# Altium project ghetto_cuda.PrjPcb (part 2 of 2)

## Sheet FPGA_IO_4.SchDoc
size A
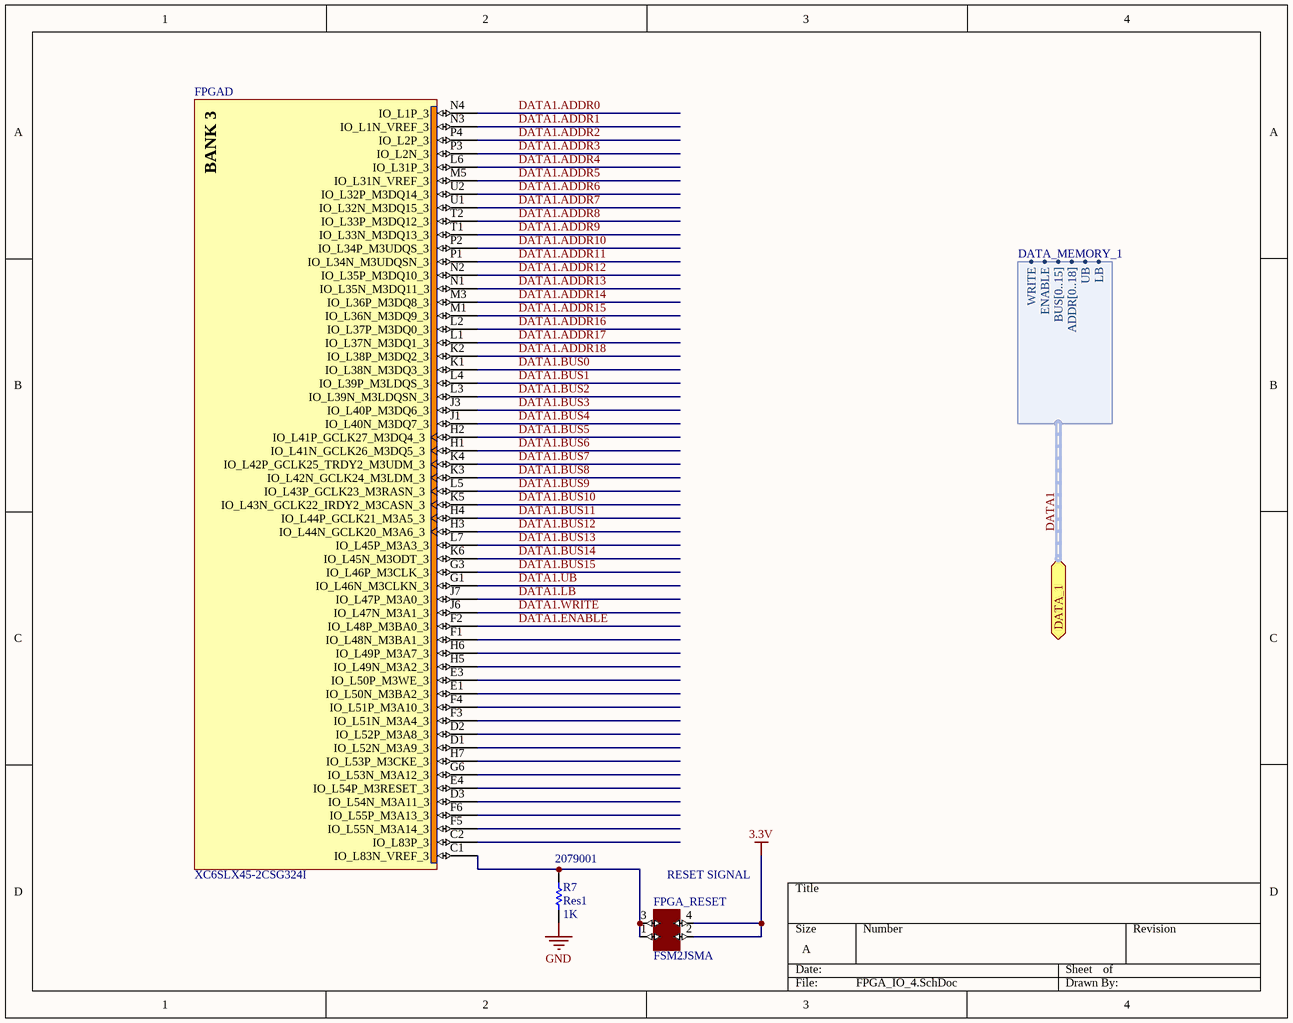
[diagram p12: FPGA_IO_4.SchDoc]

### Parts
FPGA  XC6SLX45-2CSG324I  [CSG324]  (part D of 8)
FPGA_RESET  FSM2JSMA  [Button]
R7  Res1  value 1K  Supplier Part Number 1: 2079001  [C1206]

### Ports
DATA_1 (harness DATA_MEMORY_1)

### Harnesses
DATA_MEMORY_1: WRITE, ENABLE, BUS[0..15], ADDR[0..18], UB, LB

### Nets
3.3V: FPGA_RESET.2 FPGA_RESET.4
GND: R7.2
DATA1.ADDR0: FPGA.N4(IO_L1P_3)
DATA1.ADDR1: FPGA.N3(IO_L1N_VREF_3)
DATA1.ADDR2: FPGA.P4(IO_L2P_3)
DATA1.ADDR3: FPGA.P3(IO_L2N_3)
DATA1.ADDR4: FPGA.L6(IO_L31P_3)
DATA1.ADDR5: FPGA.M5(IO_L31N_VREF_3)
DATA1.ADDR6: FPGA.U2(IO_L32P_M3DQ14_3)
DATA1.ADDR7: FPGA.U1(IO_L32N_M3DQ15_3)
DATA1.ADDR8: FPGA.T2(IO_L33P_M3DQ12_3)
DATA1.ADDR9: FPGA.T1(IO_L33N_M3DQ13_3)
DATA1.ADDR10: FPGA.P2(IO_L34P_M3UDQS_3)
DATA1.ADDR11: FPGA.P1(IO_L34N_M3UDQSN_3)
DATA1.ADDR12: FPGA.N2(IO_L35P_M3DQ10_3)
DATA1.ADDR13: FPGA.N1(IO_L35N_M3DQ11_3)
DATA1.ADDR14: FPGA.M3(IO_L36P_M3DQ8_3)
DATA1.ADDR15: FPGA.M1(IO_L36N_M3DQ9_3)
DATA1.ADDR16: FPGA.L2(IO_L37P_M3DQ0_3)
DATA1.ADDR17: FPGA.L1(IO_L37N_M3DQ1_3)
DATA1.ADDR18: FPGA.K2(IO_L38P_M3DQ2_3)
DATA1.BUS0: FPGA.K1(IO_L38N_M3DQ3_3)
DATA1.BUS1: FPGA.L4(IO_L39P_M3LDQS_3)
DATA1.BUS2: FPGA.L3(IO_L39N_M3LDQSN_3)
DATA1.BUS3: FPGA.J3(IO_L40P_M3DQ6_3)
DATA1.BUS4: FPGA.J1(IO_L40N_M3DQ7_3)
DATA1.BUS5: FPGA.H2(IO_L41P_GCLK27_M3DQ4_3)
DATA1.BUS6: FPGA.H1(IO_L41N_GCLK26_M3DQ5_3)
DATA1.BUS7: FPGA.K4(IO_L42P_GCLK25_TRDY2_M3UDM_3)
DATA1.BUS8: FPGA.K3(IO_L42N_GCLK24_M3LDM_3)
DATA1.BUS9: FPGA.L5(IO_L43P_GCLK23_M3RASN_3)
DATA1.BUS10: FPGA.K5(IO_L43N_GCLK22_IRDY2_M3CASN_3)
DATA1.BUS11: FPGA.H4(IO_L44P_GCLK21_M3A5_3)
DATA1.BUS12: FPGA.H3(IO_L44N_GCLK20_M3A6_3)
DATA1.BUS13: FPGA.L7(IO_L45P_M3A3_3)
DATA1.BUS14: FPGA.K6(IO_L45N_M3ODT_3)
DATA1.BUS15: FPGA.G3(IO_L46P_M3CLK_3)
DATA1.ENABLE: FPGA.F2(IO_L48P_M3BA0_3)
DATA1.LB: FPGA.J7(IO_L47P_M3A0_3)
DATA1.UB: FPGA.G1(IO_L46N_M3CLKN_3)
DATA1.WRITE: FPGA.J6(IO_L47N_M3A1_3)
NetFPGA_C1: FPGA.C1(IO_L83N_VREF_3) FPGA_RESET.1 FPGA_RESET.3 R7.1

Not connected (* = marked no-connect by the designer): FPGA C2(IO_L83P_3) D1(IO_L52N_M3A9_3) D2(IO_L52P_M3A8_3) D3(IO_L54N_M3A11_3) E1(IO_L50N_M3BA2_3) E3(IO_L50P_M3WE_3) E4(IO_L54P_M3RESET_3) F1(IO_L48N_M3BA1_3) F3(IO_L51N_M3A4_3) F4(IO_L51P_M3A10_3) F5(IO_L55N_M3A14_3) F6(IO_L55P_M3A13_3) G6(IO_L53N_M3A12_3) H5(IO_L49N_M3A2_3) H6(IO_L49P_M3A7_3) H7(IO_L53P_M3CKE_3)

### Buses and harness runs
harness DATA1 = port DATA_1

### Notes on the sheet
- (near FPGA_RESET) RESET SIGNAL
- (in symbol CMP-0067-00402-1, part D) BANK 3

### Library data of the parts
FPGA = CMP-0067-00402-1: Spartan-6 LX 1.2V FPGA, 218 User I/Os, 324-Ball Chip-Scale BGA (0.8mm Pitch), Speed Grade 2, Industrial Grade, Pb-Free; Code_JEDEC: MO-275-KKAC-1; PackageDescription: 324-Ball Chip-Scale BGA (CSG324) Package, 0.8 mm Pitch; DatasheetVersion: ver1.6, Nov-2010; PackageVersion: ver1.1, Nov-2009; PackageReference: CSG324
FPGA_RESET = switch-button
R7 = Res1: Resistor; Manufacturer: WELWYN; Manufacturer Part Number: ASC1206-1K0FT5; Description: WELWYN - ASC1206-1K0FT5 - RESISTOR, ANTI SULPHUR, 1206, 1K0; Product Range: WELWYN - ASC Series; Resistance: 1; Power Rating: 250; Resistance Tolerance: ± 1%; Resistor Case Style: 1206 [3216 Metric]; Resistor Element Material: Thick Film; Temperature Coefficient: ± 100; Voltage Rating: 200; SVHC: No SVHC (16-Jun-2014); Resistor Mounting: SMD<!--FANDB--><div class="features-and-benefits-container"></div>; Published: 8-Jun-2000; LatestRevisionDate: 17-Jul-2002; LatestRevisionNote: Re-released for DXP Platform.; PackageReference: AXIAL-0.3; Publisher: Altium Limited; PackageDescription: Axial Device, Thru-Hole; 2 Leads; 0.3 in Pin Spacing; Supplier 1: Farnell; RoHS: YES; Stock 1: 41610; Pricing 1: 100=0,1895, 500=0,1514, 1000=0,1401, 5000=0,1112 (EUR); Packaging: Cut Tape; MSL: -; ComponentLink1URL: http://www.farnell.com/datasheets/1682355.pdf; ComponentLink1Description: http://www.farnell.com/datasheets/1682355.pdf

## Sheet FPGA_CLK_SUSPEND.SchDoc
size A
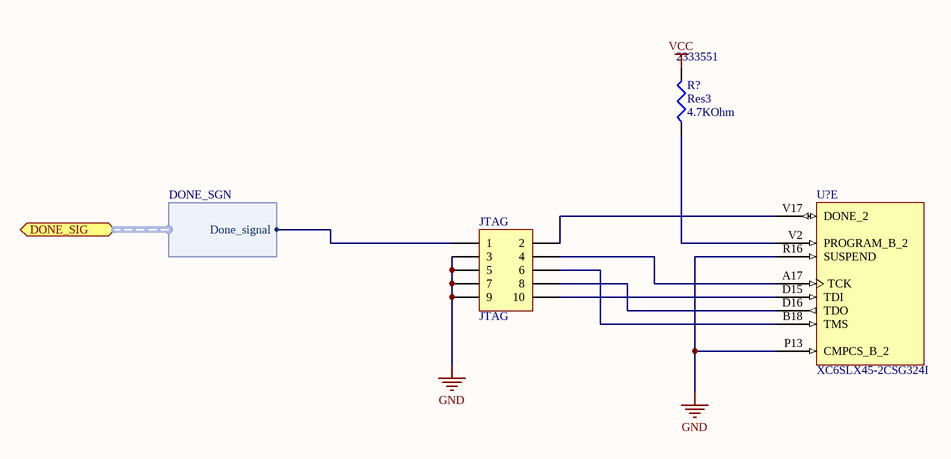
[diagram p13: FPGA_CLK_SUSPEND.SchDoc]

### Parts
JTAG  JTAG  [HDR2X5]
R?  Res3  value 4.7KOhm  Supplier Part Number 1: 2333551  [C1206]
U?  XC6SLX45-2CSG324I  [CSG324]  (part E of 8)

### Ports
DONE_SIG (harness DONE_SGN)

### Harnesses
DONE_SGN: Done_signal

### Nets
GND: JTAG.3 JTAG.5 JTAG.7 JTAG.9 U?.P13(CMPCS_B_2) U?.R16(SUSPEND)
VCC: R?.2
NetJTAG_1: JTAG.1 ; port DONE_SIG.Done_signal
NetJTAG_2: JTAG.2 U?.V17(DONE_2)
NetJTAG_4: JTAG.4 U?.A17(TCK)
NetJTAG_6: JTAG.6 U?.B18(TMS)
NetJTAG_8: JTAG.8 U?.D16(TDO)
NetJTAG_10: JTAG.10 U?.D15(TDI)
NetR?_1: R?.1 U?.V2(PROGRAM_B_2)

### Library data of the parts
JTAG = Header 5X2: Header, 5-Pin, Dual row; LatestRevisionDate: 17-Jul-2002; LatestRevisionNote: Re-released for DXP Platform.; Publisher: Altium Limited
R? = Res3: Resistor; Manufacturer: BOURNS; Manufacturer Part Number: CR1206-FX-4701ELF; Description: BOURNS - CR1206-FX-4701ELF - RESISTOR THICK FILM, 4.7KOHM, 1%, 1206; Product Range: BOURNS - CR Series; Resistance: 4.7; Power Rating: 250; Resistance Tolerance: ± 1%; Resistor Case Style: 1206 [3216 Metric]; Resistor Element Material: Thick Film; Temperature Coefficient: ± 100; Voltage Rating: 200; SVHC: No SVHC (16-Jun-2014; Published: 8-Jun-2000; LatestRevisionDate: 29-May-2009; LatestRevisionNote: IPC-7351 Footprint Added.; PackageReference: J1-0603; Publisher: Altium Limited; PackageDescription: Chip Resistor; Supplier 1: Farnell; RoHS: YES; Stock 1: 12041; Pricing 1: 1=0.453, 10=0.34, 50=0.278, 100=0.216, 500=0.1607, 1000=0.1339 (EUR); Packaging: Cut Tape; MSL: -; ComponentLink1URL: http://www.farnell.com/datasheets/691949.pdf; ComponentLink1Description: http://www.farnell.com/datasheets/691949.pdf
U? = CMP-0067-00402-1: as FPGA on sheet FPGA_IO_4; Code_JEDEC: MO-275-KKAC-1; PackageDescription: 324-Ball Chip-Scale BGA (CSG324) Package, 0.8 mm Pitch; DatasheetVersion: ver1.6, Nov-2010; PackageVersion: ver1.1, Nov-2009; PackageReference: CSG324

## Sheet FPGA_GND.SchDoc
size A
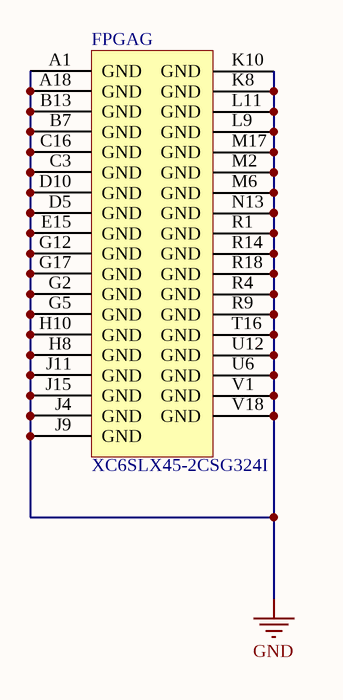
[diagram p14: FPGA_GND.SchDoc]

### Parts
FPGA  XC6SLX45-2CSG324I  [CSG324]  (part G of 8)

### Nets
GND: FPGA.A1(GND) FPGA.A18(GND) FPGA.B7(GND) FPGA.B13(GND) FPGA.C3(GND) FPGA.C16(GND) FPGA.D5(GND) FPGA.D10(GND) FPGA.E15(GND) FPGA.G2(GND) FPGA.G5(GND) FPGA.G12(GND) FPGA.G17(GND) FPGA.H8(GND) FPGA.H10(GND) FPGA.J4(GND) FPGA.J9(GND) FPGA.J11(GND) FPGA.J15(GND) FPGA.K8(GND) FPGA.K10(GND) FPGA.L9(GND) FPGA.L11(GND) FPGA.M2(GND) FPGA.M6(GND) FPGA.M17(GND) FPGA.N13(GND) FPGA.R1(GND) FPGA.R4(GND) FPGA.R9(GND) FPGA.R14(GND) FPGA.R18(GND) FPGA.T16(GND) FPGA.U6(GND) FPGA.U12(GND) FPGA.V1(GND) FPGA.V18(GND)

### Library data of the parts
FPGA = CMP-0067-00402-1: as FPGA on sheet FPGA_IO_4; Code_JEDEC: MO-275-KKAC-1; PackageDescription: 324-Ball Chip-Scale BGA (CSG324) Package, 0.8 mm Pitch; DatasheetVersion: ver1.6, Nov-2010; PackageVersion: ver1.1, Nov-2009; PackageReference: CSG324

## Sheet FPGA_VCC.SchDoc
size A
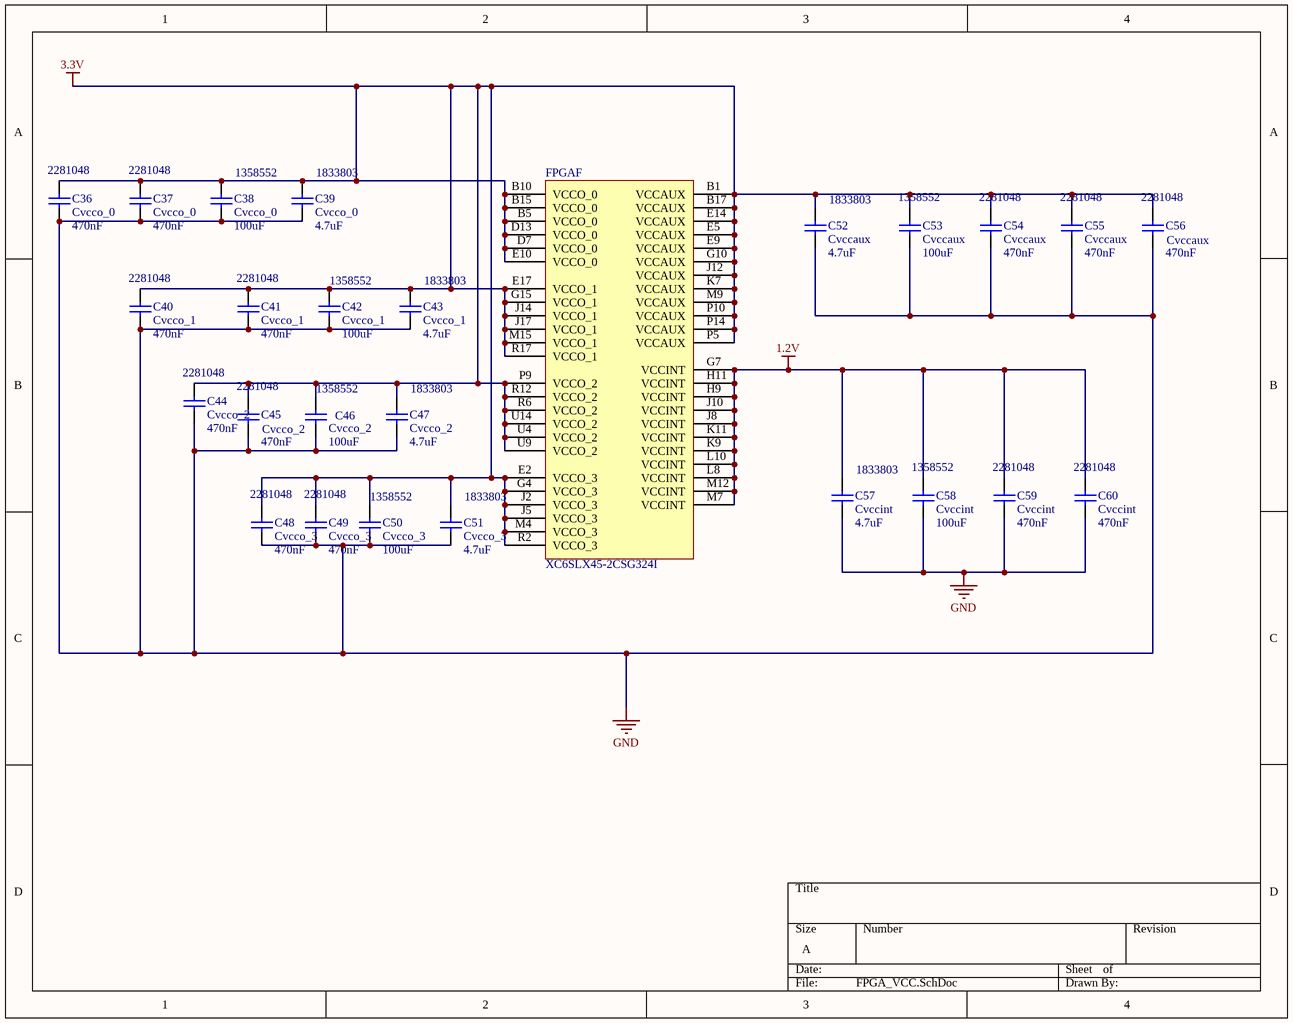
[diagram p15: FPGA_VCC.SchDoc]

### Parts
C36  Cvcco_0  value 470nF  Supplier Part Number 1: 2281048  [C1206]
C37  Cvcco_0  value 470nF  Supplier Part Number 1: 2281048  [C1206]
C38  Cvcco_0  value 100uF  Supplier Part Number 1: 1358552  [C1206]
C39  Cvcco_0  value 4.7uF  Supplier Part Number 1: 1833803  [C1206]
C40  Cvcco_1  value 470nF  Supplier Part Number 1: 2281048  [C1206]
C41  Cvcco_1  value 470nF  Supplier Part Number 1: 2281048  [C1206]
C42  Cvcco_1  value 100uF  Supplier Part Number 1: 1358552  [C1206]
C43  Cvcco_1  value 4.7uF  Supplier Part Number 1: 1833803  [C1206]
C44  Cvcco_2  value 470nF  Supplier Part Number 1: 2281048  [C1206]
C45  Cvcco_2  value 470nF  Supplier Part Number 1: 2281048  [C1206]
C46  Cvcco_2  value 100uF  Supplier Part Number 1: 1358552  [C1206]
C47  Cvcco_2  value 4.7uF  Supplier Part Number 1: 1833803  [C1206]
C48  Cvcco_3  value 470nF  Supplier Part Number 1: 2281048  [C1206]
C49  Cvcco_3  value 470nF  Supplier Part Number 1: 2281048  [C1206]
C50  Cvcco_3  value 100uF  Supplier Part Number 1: 1358552  [C1206]
C51  Cvcco_3  value 4.7uF  Supplier Part Number 1: 1833803  [C1206]
C52  Cvccaux  value 4.7uF  Supplier Part Number 1: 1833803  [C1206]
C53  Cvccaux  value 100uF  Supplier Part Number 1: 1358552  [C1206]
C54  Cvccaux  value 470nF  Supplier Part Number 1: 2281048  [C1206]
C55  Cvccaux  value 470nF  Supplier Part Number 1: 2281048  [C1206]
C56  Cvccaux  value 470nF  Supplier Part Number 1: 2281048  [C1206]
C57  Cvccint  value 4.7uF  Supplier Part Number 1: 1833803  [C1206]
C58  Cvccint  value 100uF  Supplier Part Number 1: 1358552  [C1206]
C59  Cvccint  value 470nF  Supplier Part Number 1: 2281048  [C1206]
C60  Cvccint  value 470nF  Supplier Part Number 1: 2281048  [C1206]
FPGA  XC6SLX45-2CSG324I  [CSG324]  (part F of 8)

### Nets
1.2V: C57.2 C58.2 C59.1 C60.1 FPGA.G7(VCCINT) FPGA.H9(VCCINT) FPGA.H11(VCCINT) FPGA.J8(VCCINT) FPGA.J10(VCCINT) FPGA.K9(VCCINT) FPGA.K11(VCCINT) FPGA.L8(VCCINT) FPGA.L10(VCCINT) FPGA.M7(VCCINT) FPGA.M12(VCCINT)
3.3V: C36.1 C37.1 C38.2 C39.2 C40.1 C41.1 C42.1 C43.2 C44.1 C45.1 C46.2 C47.2 C48.1 C49.1 C50.2 C51.2 C52.2 C53.2 C54.1 C55.1 C56.1 FPGA.B1(VCCAUX) FPGA.B5(VCCO_0) FPGA.B10(VCCO_0) FPGA.B15(VCCO_0) FPGA.B17(VCCAUX) FPGA.D7(VCCO_0) FPGA.D13(VCCO_0) FPGA.E2(VCCO_3) FPGA.E5(VCCAUX) FPGA.E9(VCCAUX) FPGA.E10(VCCO_0) FPGA.E14(VCCAUX) FPGA.E17(VCCO_1) FPGA.G4(VCCO_3) FPGA.G10(VCCAUX) FPGA.G15(VCCO_1) FPGA.J2(VCCO_3) FPGA.J5(VCCO_3) FPGA.J12(VCCAUX) FPGA.J14(VCCO_1) FPGA.J17(VCCO_1) FPGA.K7(VCCAUX) FPGA.M4(VCCO_3) FPGA.M9(VCCAUX) FPGA.M15(VCCO_1) FPGA.P5(VCCAUX) FPGA.P9(VCCO_2) FPGA.P10(VCCAUX) FPGA.P14(VCCAUX) FPGA.R2(VCCO_3) FPGA.R6(VCCO_2) FPGA.R12(VCCO_2) FPGA.R17(VCCO_1) FPGA.U4(VCCO_2) FPGA.U9(VCCO_2) FPGA.U14(VCCO_2)
GND: C36.2 C37.2 C38.1 C39.1 C40.2 C41.2 C42.2 C43.1 C44.2 C45.2 C46.1 C47.1 C48.2 C49.2 C50.1 C51.1 C52.1 C53.1 C54.2 C55.2 C56.2 C57.1 C58.1 C59.2 C60.2

### Library data of the parts
C36 C37 C40 C41 C44 C45 C48 C49 C54-C56 C59 C60 = Cap Semi: Capacitor (Semiconductor SIM Model); Manufacturer: AVX; Manufacturer Part Number: 12061C474KAT2A; Published: 8-Jun-2000; LatestRevisionDate: 29-May-2009; LatestRevisionNote: IPC-7351 Footprint Added.; PackageReference: C1206; Publisher: Altium Limited; PackageDescription: Chip Capacitor; Supplier 1: Farnell; RoHS: YES; Stock 1: 70000; Pricing 1: 2000=0.648, 10000=0.56, 20000=0.504 (EUR); ComponentLink1URL: http://www.farnell.com/datasheets/1679506.pdf; ComponentLink1Description: http://www.farnell.com/datasheets/1679506.pdf
C38 C42 C46 C50 C53 C58 = Cap Semi: Capacitor (Semiconductor SIM Model); Manufacturer: KEMET; Manufacturer Part Number: C1206C107M9PACTU; Product Range: KEMET - C Series; Capacitance: 100; Capacitance Tolerance: ± 20%; Dielectric Characteristic: X5; Voltage Rating: 6.3; Ceramic Capacitor Case: 1206 [3216 Metric]; SVHC: No SVHC (16-Dec-2013); Capacitor Terminals: SMD; Published: 8-Jun-2000; LatestRevisionDate: 29-May-2009; LatestRevisionNote: IPC-7351 Footprint Added.; PackageReference: C1206; Publisher: Altium Limited; PackageDescription: Chip Capacitor; Supplier 1: Farnell; RoHS: YES; Stock 1: 24189; Pricing 1: 1=5.39, 100=3.03, 1000=2.68, 4000=2.6 (EUR); Operating Temperature Min: -55; Operating Temperature Max: 85; Packaging: Cut Tape; MSL: MSL 1 - Unlimited; Capacitance Tolerance ±: ± 20%; Capacitor Case Style: 1206 [3216 Metric]; Operating Temperature Range: -55°C to +85; Terminal Type: Surface Mount (SMD, SMT)<!--FANDB--><div class="features-and-benefits-container"></div>; ComponentLink1URL: http://www.farnell.com/datasheets/1732717.pdf; ComponentLink1Description: http://www.farnell.com/datasheets/1732717.pdf; ComponentLink2URL: http://www.farnell.com/cad/1558721.zip; ComponentLink2Description: http://www.farnell.com/cad/1558721.zip
  C42 C46: ComponentLink3URL: http://www.farnell.com/datasheets/1679506.pdf; ComponentLink3Description: http://www.farnell.com/datasheets/1679506.pdf
C39 C43 C47 C51 C52 C57 = Cap Semi: Capacitor (Semiconductor SIM Model); Manufacturer: AVX; Manufacturer Part Number: 06036D475KAT2A; Published: 8-Jun-2000; LatestRevisionDate: 29-May-2009; LatestRevisionNote: IPC-7351 Footprint Added.; PackageReference: C1206; Publisher: Altium Limited; PackageDescription: Chip Capacitor; Supplier 1: Farnell; RoHS: YES; Stock 1: 17276; Pricing 1: 10=1.65, 100=1.02, 500=0.44, 1000=0.36, 2000=0.29 (EUR); ComponentLink1URL: http://www.farnell.com/datasheets/1796776.pdf; ComponentLink1Description: http://www.farnell.com/datasheets/1796776.pdf
FPGA = CMP-0067-00402-1: as FPGA on sheet FPGA_IO_4; Code_JEDEC: MO-275-KKAC-1; PackageDescription: 324-Ball Chip-Scale BGA (CSG324) Package, 0.8 mm Pitch; DatasheetVersion: ver1.6, Nov-2010; PackageVersion: ver1.1, Nov-2009; PackageReference: CSG324

## Sheet Status_LEDS.SchDoc
size A4
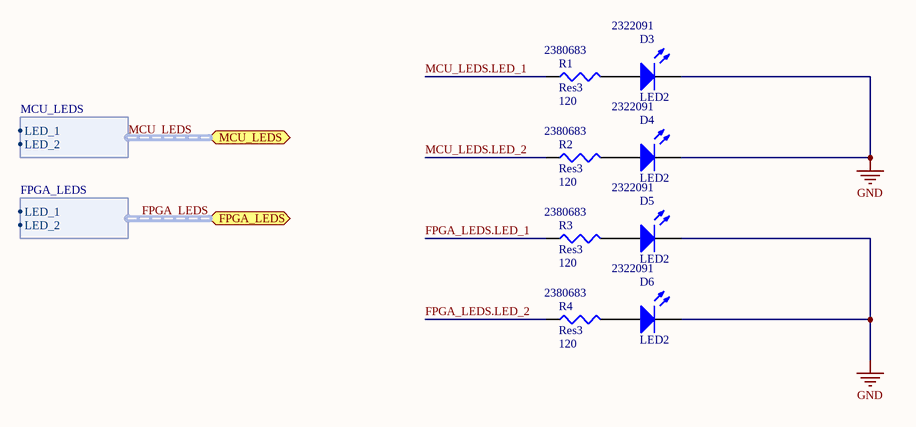
[diagram p16: Status_LEDS.SchDoc]

### Parts
D3  LED2  Supplier Part Number 1: 2322091  [C1206]
D4  LED2  Supplier Part Number 1: 2322091  [C1206]
D5  LED2  Supplier Part Number 1: 2322091  [C1206]
D6  LED2  Supplier Part Number 1: 2322091  [C1206]
R1  Res3  value 120  Supplier Part Number 1: 2380683  [14-1210]
R2  Res3  value 120  Supplier Part Number 1: 2380683  [14-1210]
R3  Res3  value 120  Supplier Part Number 1: 2380683  [14-1210]
R4  Res3  value 120  Supplier Part Number 1: 2380683  [14-1210]

### Ports
FPGA_LEDS (harness FPGA_LEDS), MCU_LEDS (harness MCU_LEDS)

### Harnesses
MCU_LEDS: LED_1, LED_2
FPGA_LEDS: LED_1, LED_2

### Nets
GND: D3.2(K) D4.2(K) D5.2(K) D6.2(K)
FPGA_LEDS.LED_1: R3.1
FPGA_LEDS.LED_2: R4.1
MCU_LEDS.LED_1: R1.1
MCU_LEDS.LED_2: R2.1
NetD3_1: D3.1(A) R1.2
NetD4_1: D4.1(A) R2.2
NetD5_1: D5.1(A) R3.2
NetD6_1: D6.1(A) R4.2

### Buses and harness runs
harness FPGA_LEDS = port FPGA_LEDS
harness MCU_LEDS = port MCU_LEDS

### Library data of the parts
D3-D6 = LED2: Typical RED, GREEN, YELLOW, AMBER GaAs LED; Manufacturer: WURTH ELEKTRONIK; Manufacturer Part Number: 156120GS75300; Published: 8-Jun-2000; LatestRevisionDate: 17-Jul-2002; LatestRevisionNote: Re-released for DXP Platform.; PackageVersion: Feb-2002; PackageReference: 3.2X1.6X1.1; Publisher: Altium Limited; PackageDescription: SM LED; 2 Flat Leads; Supplier 1: Farnell; RoHS: YES; Stock 1: 15358; Pricing 1: 1=5,3, 50=4,9, 100=4,6, 500=3,65, 2000=3,3, 5000=2,95, 5000=2,65, 30000=2,4 (EUR); ComponentLink1URL: http://katalog.we-online.de/led/datasheet/156120GS75300.pdf; ComponentLink1Description: http://katalog.we-online.de/led/datasheet/156120GS75300.pdf
R1-R4 = Res3: Resistor; Manufacturer: PANASONIC; Manufacturer Part Number: ERJU14F1200U; Product Range: PANASONIC - ERJ Series; Power Rating: 500; Resistance Tolerance: ± 1%; Resistor Case Style: 1210 [3225 Metric]; Resistor Element Material: Thick Film; Temperature Coefficient: ± 100; Voltage Rating: 200; SVHC: No SVHC (16-Dec-2013; Published: 8-Jun-2000; LatestRevisionDate: 29-May-2009; LatestRevisionNote: IPC-7351 Footprint Added.; PackageReference: J1-0603; Publisher: Altium Limited; PackageDescription: Chip Resistor; Supplier 1: Farnell; RoHS: YES; Stock 1: 2870; Pricing 1: 10=1,05, 100=0,951, 500=0,734, 1000=0,589, 5000=0,434 (EUR); Resistance: 120; Packaging: Cut Tape; MSL: -; ComponentLink1URL: http://www.farnell.com/datasheets/1783557.pdf; ComponentLink1Description: http://www.farnell.com/datasheets/1783557.pdf

## Sheet MCU_IO.SchDoc
size A
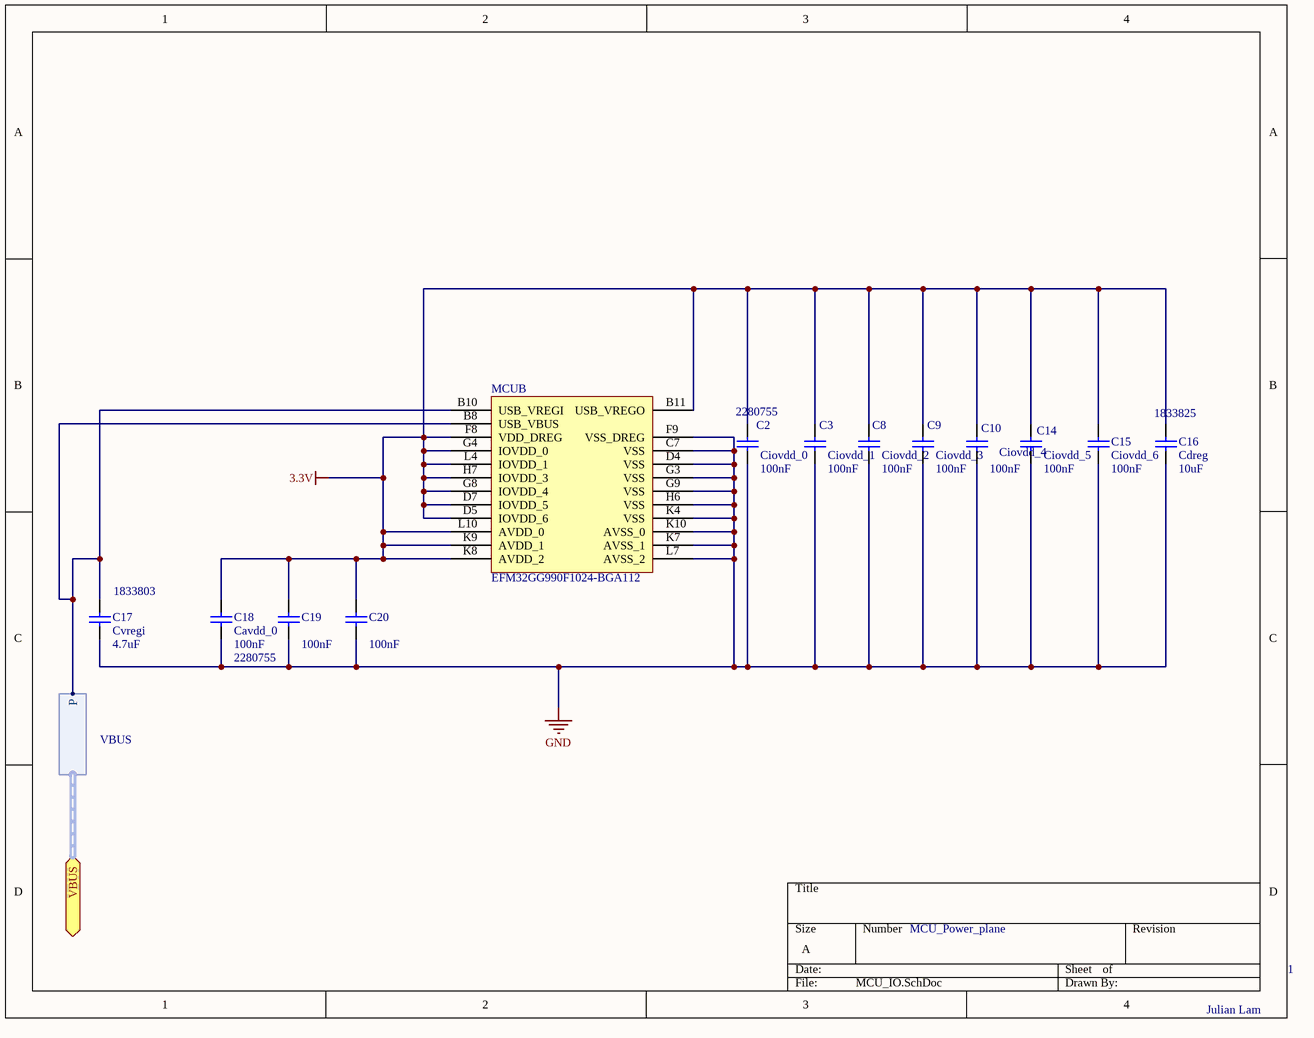
[diagram p17: MCU_IO.SchDoc]

### Parts
C2  Ciovdd_0  value 100nF  Supplier Part Number 1: 2280755  [C1206]
C3  Ciovdd_1  value 100nF  [C1206]
C8  Ciovdd_2  value 100nF  [C1206]
C9  Ciovdd_3  value 100nF  [C1206]
C10  Ciovdd_4  value 100nF  [C1206]
C14  Ciovdd_5  value 100nF  [C1206]
C15  Ciovdd_6  value 100nF  [C1206]
C16  Cdreg  value 10uF  Supplier Part Number 1: 1833825  [C1206]
C17  Cvregi  value 4.7uF  Supplier Part Number 1: 1833803  [C1206]
C18  Cavdd_0  value 100nF  Supplier Part Number 1: 2280755  [C1206]
C19  value 100nF  [C1206]  (hidden comment: Cavdd_1)
C20  value 100nF  [C1206]  (hidden comment: Cavdd_2)
MCU  EFM32GG990F1024-BGA112  [ENMR-BGA112]  (part B of 2)

### Ports
VBUS (harness VBUS)

### Harnesses
VBUS: P

### Nets
3.3V: C2.2 C3.2 C8.2 C9.2 C10.2 C14.2 C15.2 C16.2 C18.2 C19.2 C20.1 MCU.B11(USB_VREGO) MCU.D5(IOVDD_6) MCU.D7(IOVDD_5) MCU.F8(VDD_DREG) MCU.G4(IOVDD_0) MCU.G8(IOVDD_4) MCU.H7(IOVDD_3) MCU.K8(AVDD_2) MCU.K9(AVDD_1) MCU.L4(IOVDD_1) MCU.L10(AVDD_0)
GND: C2.1 C3.1 C8.1 C9.1 C10.1 C14.1 C15.1 C16.1 C17.1 C18.1 C19.1 C20.2 MCU.C7(VSS) MCU.D4(VSS) MCU.F9(VSS_DREG) MCU.G3(VSS) MCU.G9(VSS) MCU.H6(VSS) MCU.K4(VSS) MCU.K7(AVSS_1) MCU.K10(AVSS_0) MCU.L7(AVSS_2)
NetC17_2: C17.2 MCU.B8(USB_VBUS) MCU.B10(USB_VREGI) ; port VBUS.P

### Notes on the sheet
- MCU_Power_plane
- 1
- Julian Lam

### Library data of the parts
C2 C3 C8-C10 C14 C15 C18-C20 = Cap Semi: Capacitor (Semiconductor SIM Model); Manufacturer: AVX; Manufacturer Part Number: 02016D104KAT2A; Capacitance: 0.1; Capacitance Tolerance: ± 10%; Dielectric Characteristic: X5; Voltage Rating: 6.3; Ceramic Capacitor Case: 0201 [0603 Metric]; SVHC: No SVHC (16-Dec-2013); Capacitor Terminals: SMD; Reel Quantity: 15000; Published: 8-Jun-2000; LatestRevisionDate: 29-May-2009; LatestRevisionNote: IPC-7351 Footprint Added.; PackageReference: C1206; Publisher: Altium Limited; PackageDescription: Chip Capacitor; Supplier 1: Farnell; RoHS: YES; Stock 1: 30000; Pricing 1: 15000=0.0827, 75000=0.062, 150000=0.0517 (EUR); Product Range: -; Operating Temperature Min: -55; Operating Temperature Max: 85; Packaging: Tape & Reel; MSL: MSL 1 - Unlimited; Capacitance Tolerance ±: ± 10%; Capacitor Case Style: 0201 [0603 Metric]; Operating Temperature Range: -55°C to +85; ComponentLink1URL: http://www.farnell.com/datasheets/1666675.pdf; ComponentLink1Description: http://www.farnell.com/datasheets/1666675.pdf
  C3 C8-C10 C14 C15 C19 C20: Supplier Part Number 1: 2280755
C16 = Cap Semi: Capacitor (Semiconductor SIM Model); Manufacturer: AVX; Manufacturer Part Number: 12063D106KAT2A; Capacitance: 10; Capacitance Tolerance: ± 10%; Dielectric Characteristic: X5; Voltage Rating: 25; Ceramic Capacitor Case: 1206 [3216 Metric]; SVHC: No SVHC (16-Dec-2013); Capacitor Terminals: SMD; Published: 8-Jun-2000; LatestRevisionDate: 29-May-2009; LatestRevisionNote: IPC-7351 Footprint Added.; PackageReference: C1206; Publisher: Altium Limited; PackageDescription: Chip Capacitor; Supplier 1: Farnell; RoHS: YES; Stock 1: 16889; Pricing 1: 10=3.58, 100=2.42, 500=1.21, 1000=1, 2000=0.8 (EUR); Product Range: -; Operating Temperature Min: -55; Operating Temperature Max: 85; Packaging: Cut Tape; MSL: MSL 1 - Unlimited; Capacitance Tolerance ±: ± 10%; Capacitor Case Style: 1206 [3216 Metric]; Operating Temperature Range: -55°C to +85; Series: Hi-Cap MLCC<!--FANDB--><div class="features-and-benefits-container"></div>; ComponentLink1URL: http://www.farnell.com/datasheets/1796776.pdf; ComponentLink1Description: http://www.farnell.com/datasheets/1796776.pdf
C17 = Cap Semi: as C39 on sheet FPGA_VCC; Published: 8-Jun-2000; LatestRevisionDate: 29-May-2009; LatestRevisionNote: IPC-7351 Footprint Added.; PackageReference: C1206; Publisher: Altium Limited; PackageDescription: Chip Capacitor; Supplier 1: Farnell; RoHS: YES; Stock 1: 17276; Pricing 1: 10=1.65, 100=1.02, 500=0.44, 1000=0.36, 2000=0.29 (EUR); ComponentLink1URL: http://www.farnell.com/datasheets/1796776.pdf; ComponentLink1Description: http://www.farnell.com/datasheets/1796776.pdf
MCU = CMP-0270-00024-1: EFM32 Giant Gecko, M3 ARM Cortex CPU, 1024 KB Flash, 128 KB RAM, 1.85 - 3.8 V Supply, 48 MHz Max Speed, -40 to 85 degC, 112-Pin BGA, RoHS Compliant; LESENSE: Y; RAM (KB): 128; Flash (KB): 1024; LCD: 8x34; OPAMPS: 3; GPIO: 87; Max Speed (MHz): 48; ARM Cortex CPU: M3; DatasheetVersion: Rev 1.00; PartNumber: EFM32GG990F1024-BGA112; ComponentLink3Description: Package Specification; Subcategory: EFM32 Giant Gecko; PackageReference: BGA112; ComponentLink3URL: http://cdn.energymicro.com/dl/devices/pdf/d0007_efm32g290_datasheet.pdf; ComponentLink2Description: Datasheet; USB: Y; PackageDescription: 112-Pin Ball Grid Array, Body 10 x 10 mm, Pitch 0.8 mm; PackageVersion: Rev. 97SPP01315A_X03_06Jun11; ComponentLink1Description: Manufacturer URL; Supply Voltage (V): 1.85 - 3.8; Mounting Technology: Surface Mount; ComponentLink1URL: http://www.energymicro.com/; Generic Part Number: EFM32GG990; ComponentLink2URL: http://cdn.energymicro.com/dl/devices/pdf/d0046_efm32gg990_datasheet.pdf

## Sheet MCU_oscilliation.SchDoc
size A4
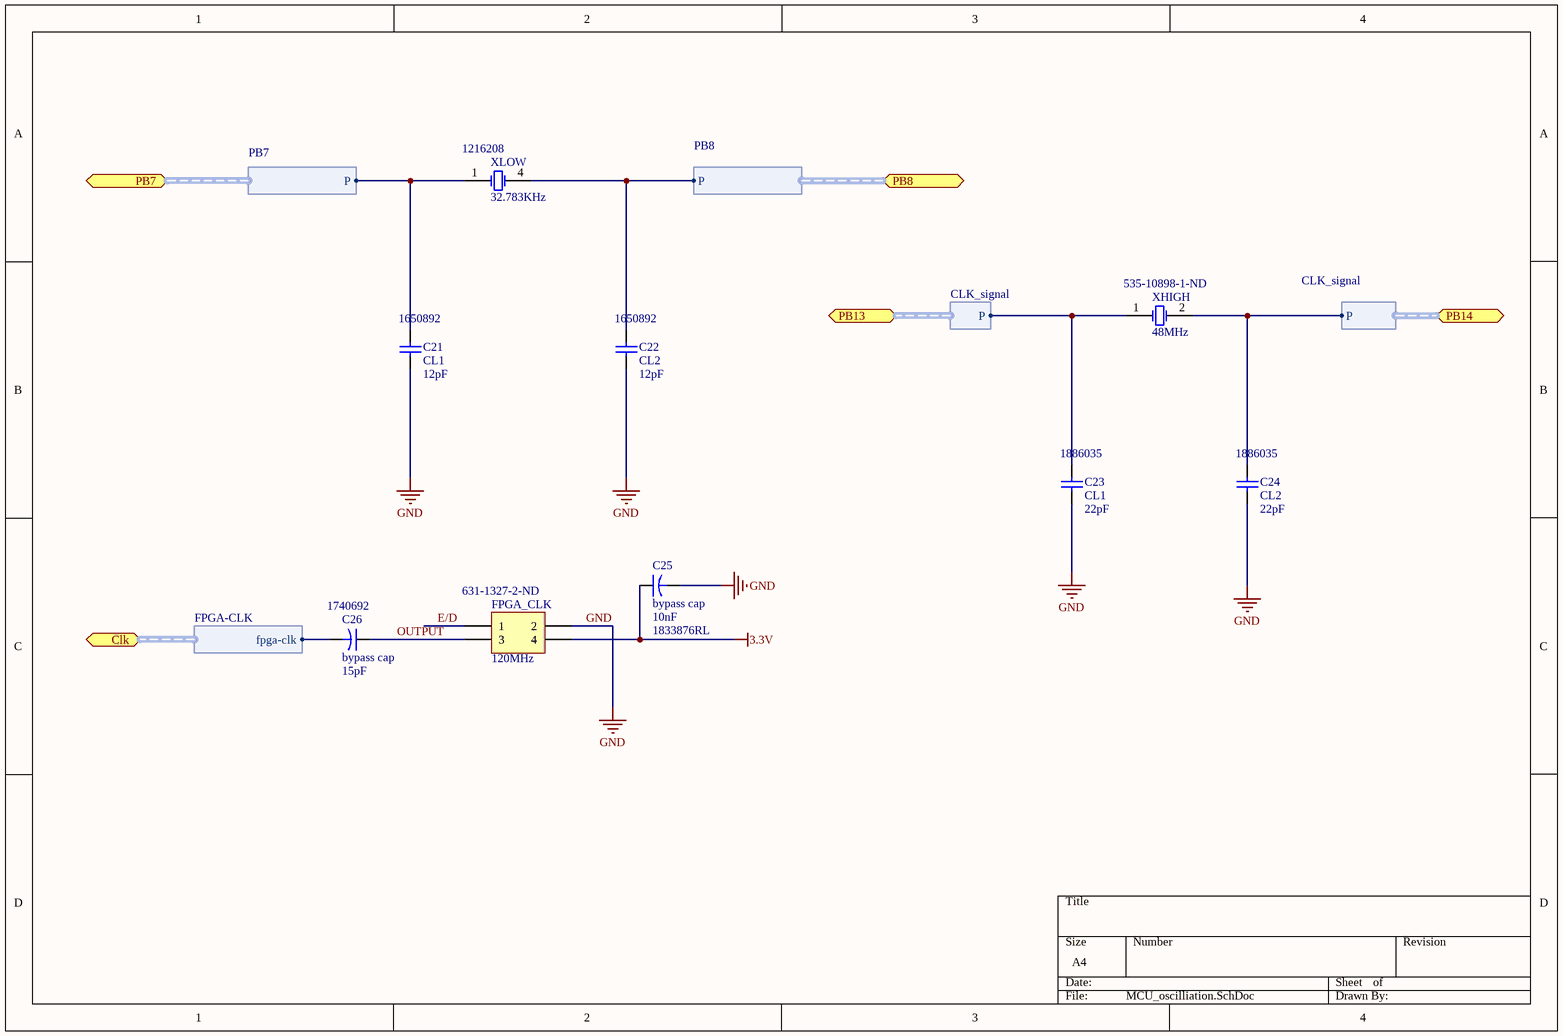
[diagram p18: MCU_oscilliation.SchDoc]

### Parts
C21  CL1  value 12pF  Supplier Part Number 1: 1650892  [C1206]
C22  CL2  value 12pF  Supplier Part Number 1: 1650892  [C1206]
C23  CL1  value 22pF  Supplier Part Number 1: 1886035  [C1206]
C24  CL2  value 22pF  Supplier Part Number 1: 1886035  [C1206]
C25  bypass cap  value 10nF  Supplier Part Number 1: 1833876RL  [C1206]
C26  bypass cap  value 15pF  Supplier Part Number 1: 1740692  [C1206]
FPGA_CLK  120MHz  Supplier Part Number 1: 631-1327-2-ND  [OSCI-4FPGA]
XHIGH  48MHz  Supplier Part Number 1: 535-10898-1-ND  [XTAL-85]
XLOW  32.783KHz  Supplier Part Number 1: 1216208  [MC-306]

### Ports
Clk (harness FPGA-CLK), PB7 (harness PB7), PB8 (harness PB8), PB13 (harness CLK_signal), PB14 (harness CLK_signal)

### Harnesses
PB7: P
PB8: P
CLK_signal: P
FPGA-CLK: fpga-clk

### Nets
3.3V: C25.1 FPGA_CLK.4
GND: C21.1 C22.1 C23.1 C24.1 C25.2 FPGA_CLK.2
CLK: C26.2 ; port Clk.fpga-clk
E/D: FPGA_CLK.1
OUTPUT: C26.1 FPGA_CLK.3
NetC21_2: C21.2 XLOW.1(OSC1) ; port PB7.P
NetC22_2: C22.2 XLOW.4(OSC2) ; port PB8.P
NetC23_2: C23.2 XHIGH.1(OSC1) ; port PB13.P
NetC24_2: C24.2 XHIGH.2(OSC2) ; port PB14.P

### Library data of the parts
C21 C22 = Cap Semi: Capacitor (Semiconductor SIM Model); Manufacturer: KEMET; Manufacturer Part Number: C1206C120J5GACTU; Product Range: KEMET - C Series; Capacitance: 12; Capacitance Tolerance: ± 5%; Dielectric Characteristic: C0G / NP0; Voltage Rating: 50; Ceramic Capacitor Case: 1206 [3216 Metric]; SVHC: No SVHC (16-Dec-2013); Capacitor Terminals: SMD; Temperature Coefficient: 0ppm/°C ± 30; Published: 8-Jun-2000; LatestRevisionDate: 29-May-2009; LatestRevisionNote: IPC-7351 Footprint Added.; PackageReference: C1206; Publisher: Altium Limited; PackageDescription: Chip Capacitor; Supplier 1: Farnell; RoHS: YES; Stock 1: 13114; Pricing 1: 1=1.12, 25=0.95, 50=0.52, 100=0.34, 500=0.29 (EUR); Operating Temperature Min: -55; Operating Temperature Max: 125; Packaging: Cut Tape; MSL: MSL 1 - Unlimited; Capacitance Tolerance ±: ± 5%; Capacitor Case Style: 1206 [3216 Metric]; Operating Temperature Range: -55°C to +125; ComponentLink1URL: http://www.farnell.com/datasheets/1732697.pdf; ComponentLink1Description: http://www.farnell.com/datasheets/1732697.pdf
C23 C24 = Cap Semi: Capacitor (Semiconductor SIM Model); Manufacturer: JOHANSON DIELECTRICS; Manufacturer Part Number: 102R18N220JV4E; Published: 8-Jun-2000; LatestRevisionDate: 29-May-2009; LatestRevisionNote: IPC-7351 Footprint Added.; PackageReference: C1206; Publisher: Altium Limited; PackageDescription: Chip Capacitor; Supplier 1: Farnell; RoHS: YES; Stock 1: 3550; Pricing 1: 50=1.3, 250=0.859, 500=0.626, 1000=0.509, 3000=0.478 (EUR); ComponentLink1URL: http://www.johansondielectrics.com/product-catalog.html; ComponentLink1Description: http://www.johansondielectrics.com/product-catalog.html; ComponentLink2URL: http://www.johansondielectrics.com/images/stories/catalog/JDI_Full-Catalog_2012-01.pdf; ComponentLink2Description: http://www.johansondielectrics.com/images/stories/catalog/JDI_Full-Catalog_2012-01.pdf
C25 C26 = Cap2: Capacitor; Manufacturer: AVX; Manufacturer Part Number: 06031C103JAT2A; Capacitance: 0.01; Capacitance Tolerance: ± 5%; Dielectric Characteristic: X7; Voltage Rating: 100; Ceramic Capacitor Case: 0603 ^1608 Metric]; Published: 23-Sep-2002; PackageReference: CAPR5-4X5; Publisher: Altium Limited; PackageDescription: Capacitor; 2 Leads; RoHS: YES; Product Range: -; Packaging: Cut Tape; ComponentLink1URL: http://www.farnell.com/datasheets/84526.pdf; ComponentLink1Description: http://www.farnell.com/datasheets/84526.pdf; Supplier 1: Farnell
FPGA_CLK = Header 2X2: Header, 2-Pin, Dual row; Manufacturer: Fox Electronics; Manufacturer Part Number: FXO-HC736R-120; Function: Tri-State (Output Enable); Output: HCMOS; Voltage - Supply: 3.3V; Frequency Stability: ±25ppm; Current - Supply (Max): 47mA; LatestRevisionDate: 17-Jul-2002; LatestRevisionNote: Re-released for DXP Platform.; Publisher: Altium Limited; Supplier 1: Digi-Key; RoHS: RoHS Compliant; Category: Crystals and Oscillators; Stock 1: 200; Pricing 1: 1000=1.42097, 3000=1.32297, 5000=1.27398, 10000=1.22498 (EUR); Packaging: Tape & Reel (TR); Type: XO (Standard); Frequency: 120MHz; Operating Temperature: -40°C ~ 85°C; Ratings: -; Mounting Type: Surface Mount; Size / Dimension: 0.295" L x 0.205" W (7.50mm x 5.20mm); Height: 0.055" (1.40mm); Package / Case: 4-SMD, No Lead (DFN, LCC); Current - Supply (Disable) (Max): -; ComponentLink1URL: http://www.foxonline.com/pdfs/FXO_HC73.pdf; ComponentLink1Description: http://www.foxonline.com/pdfs/FXO_HC73.pdf
XHIGH = XTAL: Crystal Oscillator; Manufacturer: Abracon Corporation; Manufacturer Part Number: ABM2-48.000MHZ-D4YF-T; Frequency Stability: ±30ppm; Load Capacitance: 18pF; ESR (Equivalent Series Resistance): 70 Ohm; Operating Mode: 3rd Overtone; Published: 8-Jun-2000; LatestRevisionDate: 17-Jul-2002; LatestRevisionNote: Re-released for DXP Platform.; PackageReference: R38; Publisher: Altium Limited; PackageDescription: Crystal, Thru-Hole; 2 Leads; Body 3.1 x 8.2 mm (Dia.xH); Supplier 1: Digi-Key; RoHS: RoHS Compliant; Category: Crystals and Oscillators; Stock 1: 1458; Pricing 1: 1=0.62, 10=0.525, 50=0.4708, 100=0.4189, 500=0.39894 (EUR); Packaging: Cut Tape (CT); Type: MHz Crystal; Frequency: 48MHz; Frequency Tolerance: ±30ppm; Operating Temperature: -40°C ~ 85°C; Ratings: -; Mounting Type: Surface Mount; Package / Case: 2-SMD; Size / Dimension: 0.315" L x 0.177" W (8.00mm x 4.50mm); Height: 0.063" (1.60mm); ComponentLink1URL: http://www.abracon.com/Resonators/abm2.pdf; ComponentLink1Description: http://www.abracon.com/Resonators/abm2.pdf
XLOW = XTAL: Crystal Oscillator; Manufacturer: EPSON; Manufacturer Part Number: Q13MC30610003; Frequency: 32.768; Frequency Tolerance: ± 20; Load Capacitance: 12.5; Crystal Mounting Type: SMD; Crystal Case Type: 8mm x 3.8; No. of Pins: 4; SVHC: No SVHC (16-Jun-2014); Published: 8-Jun-2000; LatestRevisionDate: 17-Jul-2002; LatestRevisionNote: Re-released for DXP Platform.; PackageReference: R38; Publisher: Altium Limited; PackageDescription: Crystal, Thru-Hole; 2 Leads; Body 3.1 x 8.2 mm (Dia.xH); Supplier 1: Farnell; RoHS: YES; Stock 1: 7540; Pricing 1: 1=9.75, 10=7.95, 100=4.85, 250=4.1, 900=3.65, 3000=3.3, 3000=3, 20000=2.8 (EUR); Frequency Stability: -; Operating Temperature Min: -40; Operating Temperature Max: 85; Packaging: Cut Tape<!--FANDB--><div class="features-and-benefits-container"></div>; ComponentLink1URL: http://www.epsondevice.com/docs/qd/en/DownloadServlet?id=ID000663; ComponentLink1Description: http://www.epsondevice.com/docs/qd/en/DownloadServlet?id=ID000663

## Nets that join several sheets
1.2V: Power_supply (6 pins), FPGA_VCC (15 pins)
3.3V: MCU (Arm_prog.1), Power_supply (6 pins), Data_mem1 (MEMORY_Data_mem1.11 MEMORY_Data_mem1.33), Serial (C34.1), Data_mem2 (MEMORY_Data_mem2.11 MEMORY_Data_mem2.33), FPGA_IO_4 (FPGA_RESET.2 FPGA_RESET.4), FPGA_VCC (57 pins), MCU_IO (22 pins), MCU_oscilliation (C25.1 FPGA_CLK.4)
GND: MCU (12 pins), USB_data (L3.1 L4.1 USB_ESD.2), USB_power (L5.1 L6.1), Power_supply (19 pins), HDMI (6 pins), VGA (J2_VGA#1.9), Data_mem1 (MEMORY_Data_mem1.12 MEMORY_Data_mem1.34 MEMORY_Data_mem1.41), Serial (10 pins), VGA (J2_VGA#2.9), Data_mem2 (MEMORY_Data_mem2.12 MEMORY_Data_mem2.34 MEMORY_Data_mem2.41), FPGA_IO_4 (R7.2), FPGA_CLK_SUSPEND (6 pins), FPGA_GND (37 pins), FPGA_VCC (25 pins), Status_LEDS (D3.2 D4.2 D5.2 D6.2), MCU_IO (22 pins), MCU_oscilliation (6 pins)
CLK: FPGA_IO_3 (FPGA_CLK_JMP.2), MCU_oscilliation (C26.2)
CS0: MCU (MCU.D6), FPGA_IO_3 (EBI_address.6)
DATA0: MCU (MCU.B4), FPGA_IO_3 (EBI_DATA.32)
DATA1: MCU (MCU.A4), FPGA_IO_3 (EBI_DATA.30)
DATA2: MCU (MCU.C3), FPGA_IO_3 (EBI_DATA.28)
DATA3: MCU (MCU.B3), FPGA_IO_3 (EBI_DATA.26)
DATA4: MCU (MCU.A3), FPGA_IO_3 (EBI_DATA.24)
DATA5: MCU (MCU.B2), FPGA_IO_3 (EBI_DATA.22)
DATA6: MCU (MCU.A2), FPGA_IO_3 (EBI_DATA.20)
DATA7: MCU (MCU.A1), FPGA_IO_3 (EBI_DATA.18)
DATA8: MCU (MCU.B1), FPGA_IO_3 (EBI_DATA.16)
DATA10: MCU (MCU.C1), FPGA_IO_3 (EBI_DATA.12)
DATA11: MCU (MCU.D2), FPGA_IO_3 (EBI_DATA.10)
DATA12: MCU (MCU.D1), FPGA_IO_3 (EBI_DATA.8)
DATA13: MCU (MCU.E3), FPGA_IO_3 (EBI_DATA.6)
DATA14: MCU (MCU.E2), FPGA_IO_3 (EBI_DATA.4)
DATA15: MCU (MCU.E1), FPGA_IO_3 (EBI_DATA.2)
EBI.REn: MCU (MCU.C6), FPGA_IO_3 (EBI_address.2)
EBI.WE: MCU (MCU.B6), FPGA_IO_3 (EBI_address.4)
NetC17_2: USB_data (L1.1), MCU_IO (C17.2 MCU.B8 MCU.B10)
NetC21_2: MCU (MCU.K1), MCU_oscilliation (C21.2 XLOW.1)
NetC22_2: MCU (MCU.L1), MCU_oscilliation (C22.2 XLOW.4)
NetC23_2: MCU (MCU.L8), MCU_oscilliation (C23.2 XHIGH.1)
NetC24_2: MCU (MCU.L9), MCU_oscilliation (C24.2 XHIGH.2)
NetJTAG_1: MCU (MCU.A8), FPGA_CLK_SUSPEND (JTAG.1)
NetL2_1: MCU (MCU.A10), USB_data (L2.1)
NetL2_4: MCU (MCU.A11), USB_data (L2.4)
NetP5_1: USB_power (USB_POWER.1), Power_supply (P5.1)